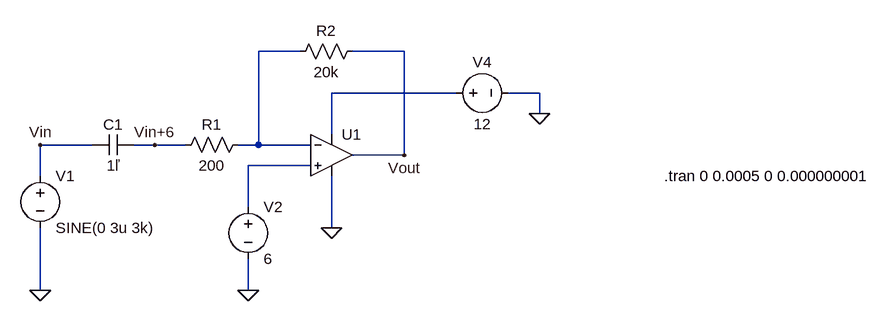
[diagram p0: schematic SP26_HookLineandTowfish_DCOffsetSimulation_JamesBrasfield.asc]
SP26_HookLineandTowfish_DCOffsetSimulation_JamesBrasfield.asc, the LTspice schematic file:
Version 4
SHEET 1 1116 680
WIRE 208 0 144 0
WIRE 368 0 288 0
WIRE 448 64 256 64
WIRE 576 64 528 64
WIRE 576 96 576 64
WIRE 256 128 256 64
WIRE -112 144 -192 144
WIRE -16 144 -48 144
WIRE 32 144 -16 144
WIRE 144 144 144 0
WIRE 144 144 112 144
WIRE 224 144 144 144
WIRE 368 160 368 0
WIRE 368 160 288 160
WIRE 224 176 128 176
WIRE -192 192 -192 144
WIRE 128 240 128 176
WIRE 256 272 256 192
WIRE -192 368 -192 272
WIRE 128 368 128 320
FLAG 128 368 0
FLAG -192 368 0
FLAG 368 160 Vout
FLAG -16 144 Vin+6
FLAG -192 144 Vin
FLAG 256 272 0
FLAG 576 96 0
SYMBOL voltage -192 176 R0
WINDOW 123 0 0 Left 0
WINDOW 39 0 0 Left 0
SYMATTR InstName V1
SYMATTR Value SINE(0 3u 3k)
SYMBOL voltage 128 224 R0
WINDOW 123 0 0 Left 0
WINDOW 39 0 0 Left 0
SYMATTR InstName V2
SYMATTR Value 6
SYMBOL cap -48 128 R90
WINDOW 0 0 32 VBottom 2
WINDOW 3 32 32 VTop 2
SYMATTR InstName C1
SYMATTR Value 1ľ
SYMBOL res 128 128 R90
WINDOW 0 0 56 VBottom 2
WINDOW 3 32 56 VTop 2
SYMATTR InstName R1
SYMATTR Value 200
SYMBOL res 304 -16 R90
WINDOW 0 0 56 VBottom 2
WINDOW 3 32 56 VTop 2
SYMATTR InstName R2
SYMATTR Value 20k
SYMBOL voltage 432 64 R270
WINDOW 0 32 56 VTop 2
WINDOW 3 -32 56 VBottom 2
WINDOW 123 0 0 Left 0
WINDOW 39 0 0 Left 0
SYMATTR InstName V4
SYMATTR Value 12
SYMBOL OpAmps\\UniversalOpAmp 256 160 R0
SYMATTR InstName U1
SYMATTR Value2 Avol=100k GBW=10Meg Vos=0
TEXT 768 192 Left 2 !.tran 0 0.0005 0 0.000000001

The netlist it stands for:
* SP26_HookLineandTowfish_DCOffsetSimulation_JamesBrasfield.asc
V1 Vin 0 SINE(0 3u 3k)
V2 N003 0 6
C1 Vin+6 Vin 1ľ
R1 N001 Vin+6 200
R2 Vout N001 20k
V4 N002 0 12
XU1 N003 N001 N002 0 Vout level1 Avol=100k GBW=10Meg Vos=0 En=0 Enk=0 In=0 Ink=0 Rin=500Meg  ; pins In+ In- V+ V- OUT
.tran 0 0.0005 0 0.000000001
.lib UniversalOpAmp1.lib
.backanno
.end